# Altium schematic sheet Sheet1.SchDoc
size A4; SheetNumber: 1; SheetTotal: 1
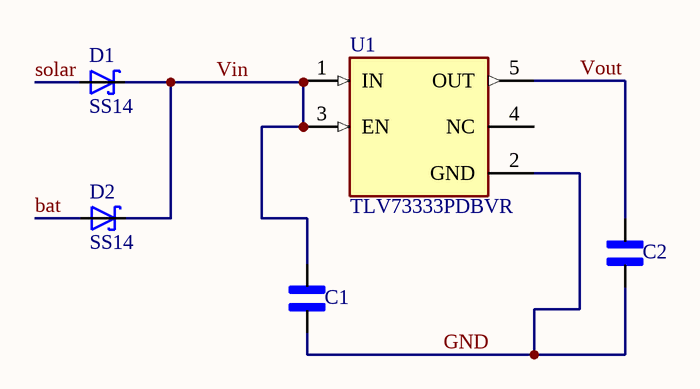
[diagram p0: Sheet1.SchDoc]

## Parts
C1  FS051C473K4Z2A  [CAPC2012X140N]  (value not drawn)
C2  FS051C473K4Z2A  [CAPC2012X140N]  (value not drawn)
D1  SS14  [DO-214AC]
D2  SS14  [DO-214AC]
U1  TLV73333PDBVR  [SOT95P280X145-5N]

## Nets
bat: D2.A
GND: C1.2 C2.2 U1.2(GND)
solar: D1.A
Vin: C1.1 D1.K D2.K U1.1(IN) U1.3(EN)
Vout: C2.1 U1.5(OUT)

Not connected (* = marked no-connect by the designer): U1 4(NC)

## Library data of the parts
C1 C2 = FS051C473K4Z2A: Ceramic Capacitor; MF: AVX; SnapEDA_Link: https://www.snapeda.com/parts/FS051C473K4Z2A/AVX/view-part/?ref=snap; Package: 0805-2 AVX; Value: *; MP: FS051C473K4Z2A; Check_prices: https://www.snapeda.com/parts/FS051C473K4Z2A/AVX/view-part/?ref=eda
D1 D2 = SS14: Diode Schottky 40 V 1A Surface Mount DO-214AC (SMA); MF: onsemi; SnapEDA_Link: https://www.snapeda.com/parts/SS14/Onsemi/view-part/?ref=snap; Package: SMA-2 ON Semiconductor; Value: *; MP: SS14; Check_prices: https://www.snapeda.com/parts/SS14/Onsemi/view-part/?ref=eda
U1 = TLV73333PDBVR: 300-mA, capacitor-free, low-IQ, low-dropout voltage regulator with enable; MF: Texas Instruments; SnapEDA_Link: https://www.snapeda.com/parts/TLV73333PDBVR/Texas+Instruments/view-part/?ref=snap; Package: SOT-23-5 Texas Instruments; Value: *; MP: TLV73333PDBVR; Check_prices: https://www.snapeda.com/parts/TLV73333PDBVR/Texas+Instruments/view-part/?ref=eda